# EAGLE schematic RasPiTimePowerSWv.1.2 (EAGLE 7.7.0)
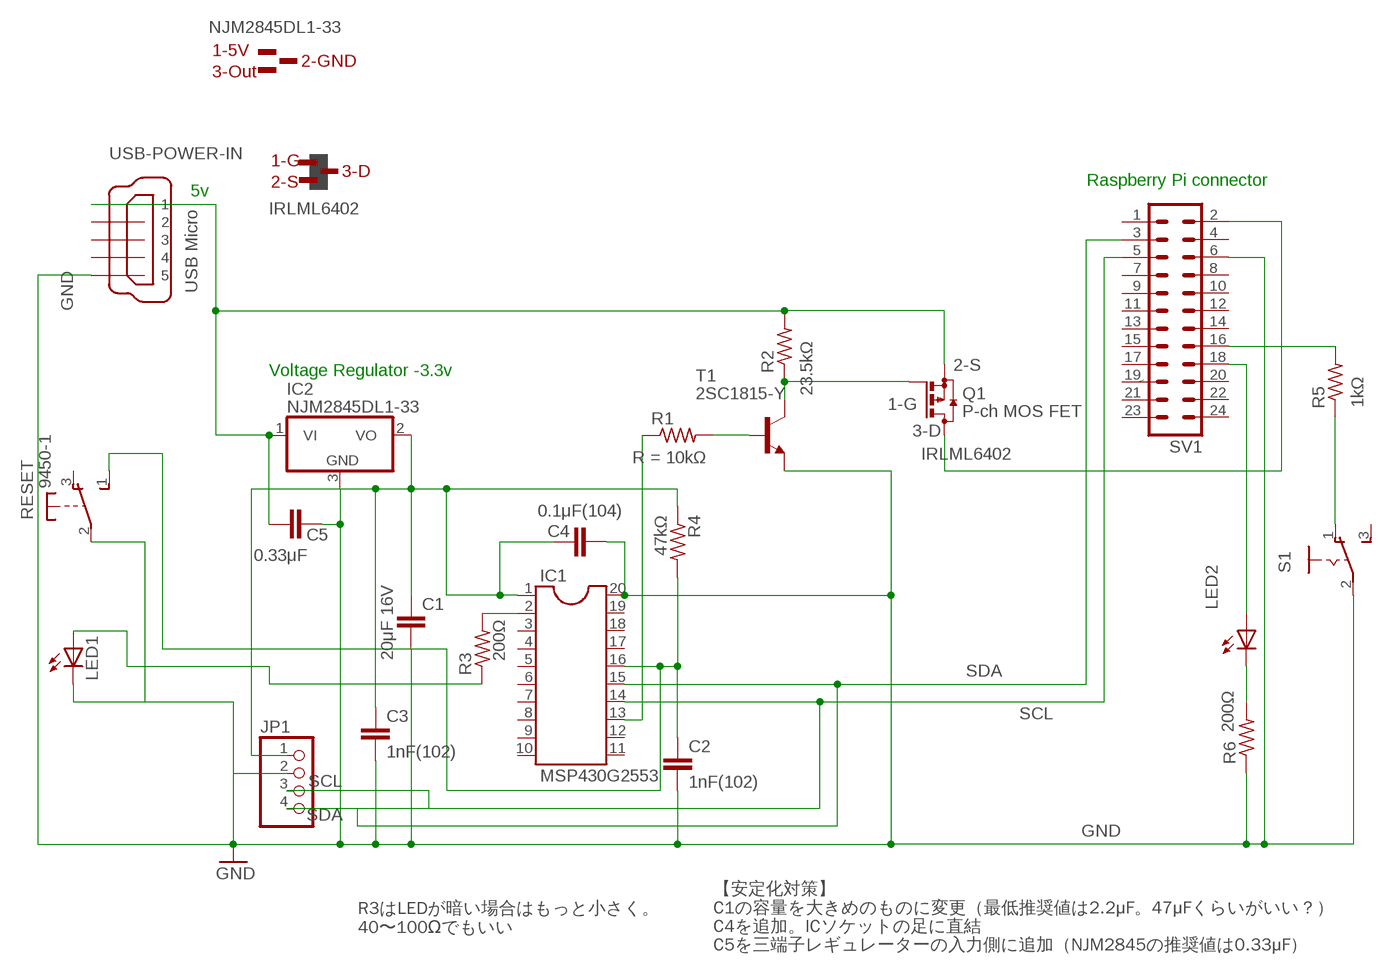
[diagram p0: schematic, sheet 1]

## Parts
C1  20μF 16V  C-EU075-042X103  [C075-042X103]
C2  1nF(102)  C-EU025-024X044  [C025-024X044]
C3  1nF(102)  C-EU025-024X044  [C025-024X044]
C4  0.1μF(104)  C-EU025-024X044  [C025-024X044]
C5  0.33μF  C-EU025-024X044  [C025-024X044]
IC1  MSP430G2553  DIL20S  [SOCKET-20]
IC2  NJM2845DL1-33  7818DT  [TO252]
JP1  PINHD-1X4  [1X04]
LED1  TLLG4400  [LED3MM]
LED2  TLLG4400  [LED3MM]
Q1  P-ch MOS FET  BSS84  [SOT23]
R1  R-US_MELF0102W  [MINI_MELF-0102W]
R2  R-US_MELF0102W  [MINI_MELF-0102W]
R3  R-US_MELF0102W  [MINI_MELF-0102W]
R4  47kΩ  R-US_MELF0102W  [MINI_MELF-0102W]
R5  R-US_MELF0102W  [MINI_MELF-0102W]
R6  R-US_MELF0102W  [MINI_MELF-0102W]
RESET  9450-1  [9450-1]
S1  255SB  [255SB]
SV1  MA12-2  [MA12-2]
T1  2SC1815-Y  2SC1815  [TO92-ECB]
USB-POWER-IN  USB Micro  MINI-USB_SHIELD5P4-32005-400  [32005-400]

## Nets
3.3V: C1.1 C3.1 C4.1 IC1.1 IC2.2(VO) JP1.1 R4.1
5V: Q1.3(D) SV1.2
5VIN: C5.2 IC2.1(VI) Q1.2(S) R2.2 USB-POWER-IN.1
GND: C1.2 C2.2 C3.2 C4.2 C5.1 IC1.20 IC2.3(GND) JP1.2 LED1.K(C) R6.1 RESET.2(P) S1.2(P) SV1.6 T1.E USB-POWER-IN.5
N$1: R1.2 T1.B
N$2: IC1.13 R1.1
N$4: IC1.2 R3.2
N$5: R5.1 S1.1(O)
N$6: Q1.1(G) R2.1 T1.C
N$7: LED1.A R3.1
N$8: R5.2 SV1.16
N$9: LED2.A SV1.18
N$10: LED2.K(C) R6.2
RESET: C2.1 IC1.16 R4.2 RESET.1(S)
SCL: IC1.14 JP1.3 SV1.5
SDA: IC1.15 JP1.4 SV1.3
Unconnected: IC1.3 IC1.4 IC1.5 IC1.6 IC1.7 IC1.8 IC1.9 IC1.10 IC1.11 IC1.12 IC1.17 IC1.18 IC1.19 RESET.3(O) S1.3(S) SV1.1 SV1.4 SV1.7 SV1.8 SV1.9 SV1.10 SV1.11 SV1.12 SV1.13 SV1.14 SV1.15 SV1.17 SV1.19 SV1.20 SV1.21 SV1.22 SV1.23 SV1.24 USB-POWER-IN.2 USB-POWER-IN.3 USB-POWER-IN.4 USB-POWER-IN.M1(S1) USB-POWER-IN.M2(S2) USB-POWER-IN.M3(S3) USB-POWER-IN.M4(S4)

## Notes on the sheet
- NJM2845DL1-33
- 1-5V
- 2-GND
- 3-Out
- 1-G
- 3-D
- 2-S | Raspberry Pi connector
- 5v
- IRLML6402
- 2-S
- Voltage Regulator -3.3v
- 1-G
- 3-D
- IRLML6402
- R3はLEDが暗い場合はもっと小さく。
  40〜100Ωでもいい
- 【安定化対策】
  C1の容量を大きめのものに変更（最低推奨値は2.2μF。47μFくらいがいい？）
  C4を追加。ICソケットの足に直結
  C5を三端子レギュレーターの入力側に追加（NJM2845の推奨値は0.33μF）

## Library data of the parts
C1-C5 = resistor:C-EU: CAPACITOR, European symbol
IC1 = ic-package:DIL20: Dual In Line / Socket
IC2 = linear:78*: Positive VOLTAGE REGULATOR Source: http://cache.national.com/ds/LM/LM78L05.pdf http://www.fairchildsemi.com/ds/LM/LM7805.pdf
JP1 = pinhead:PINHD-1X4: PIN HEADER
LED1 LED2 = led:TLLG4400: Low Current (2mA) LED 3 mm Tinted Diffused Package color GREEN Source: Data sheet <http://www.farnell.com/datasheets/391098.pdf>; MF: VISHAY SEMICONDUCTOR; OC_FARNELL: 1612435
Q1 = transistor-small-signal:BSS84: P-CHANNEL MOS FET
R1 = resistor:R-US_: RESISTOR, American symbol; R: 10kΩ
R2 = resistor:R-US_: RESISTOR, American symbol; 1K: 23.5kΩ
R3 R6 = resistor:R-US_: RESISTOR, American symbol; R: 200Ω
R4 = resistor:R-US_: RESISTOR, American symbol
R5 = resistor:R-US_: RESISTOR, American symbol; 1K: 1kΩ
RESET = switch-misc:9450-1: MARQUARDT SWITCH
S1 = switch:255SB: SLIDING SWITCH Distributor Buerklin, 11G810
SV1 = con-lstb:MA12-2: PIN HEADER; OC_FARNELL: unknown; OC_NEWARK: unknown
T1 = transistor:2SC1815: NPN EPITAXIAL TRANSISTOR Source: TOSHIBA .. 2SC1815 1.pdf
USB-POWER-IN = con-cypressindustries:MINI-USB_SHIELD5P4-: MINI USB-B R/A W/O POST 5 pol. Source: www.cypressindustries.com; OC_FARNELL: unknown; OC_NEWARK: unknown